# EAGLE design lpt_avr_programmer (EAGLE 5.10)
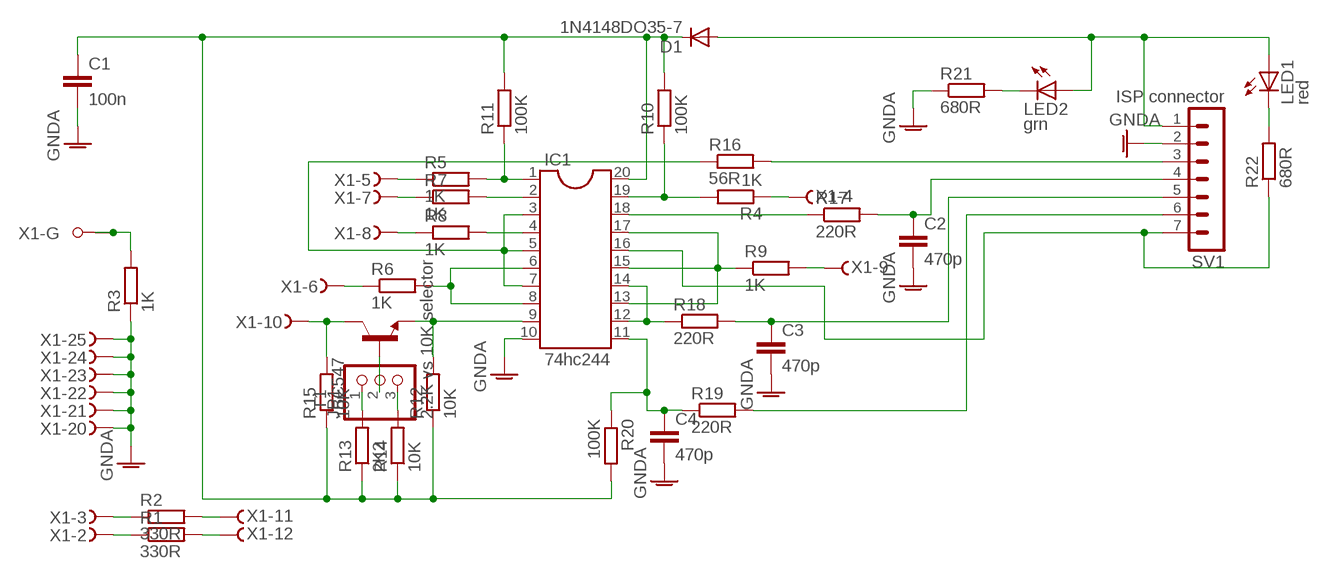
[diagram p0: schematic, sheet 1]

## Parts
C1  100n  C-EU050-025X075  [C050-025X075]
C2  470p  C-EU025-025X050  [C025-025X050]
C3  470p  C-EU025-025X050  [C025-025X050]
C4  470p  C-EU025-025X050  [C025-025X050]
D1  1N4148DO35-7  [DO35-7]
IC1  74hc244  DIL20  [DIL20]
JP1  2.2K vs 10K selector  PINHD-1X3  [1X03]
LED1  red  LED3MM  [LED3MM]
LED2  grn  LED3MM  [LED3MM]
R1  330R  RESISTOR-0207/28  [0207/28]
R2  330R  RESISTOR-0207/22  [0207/22]
R3  1K  R-EU_0207/7  [0207/7]
R4  1K  R-EU_0207/7  [0207/7]
R5  1K  R-EU_0207/7  [0207/7]
R6  1K  R-EU_0207/7  [0207/7]
R7  1K  R-EU_0207/7  [0207/7]
R8  1K  R-EU_0207/7  [0207/7]
R9  1K  RESISTOR-0207/22  [0207/22]
R10  100K  R-EU_0207/7  [0207/7]
R11  100K  R-EU_0207/7  [0207/7]
R12  10K  R-EU_0207/7  [0207/7]
R13  2K2  R-EU_0207/7  [0207/7]
R14  10K  R-EU_0207/7  [0207/7]
R15  10K  R-EU_0207/7  [0207/7]
R16  56R  R-EU_0207/7  [0207/7]
R17  220R  R-EU_0207/7  [0207/7]
R18  220R  R-EU_0207/7  [0207/7]
R19  220R  R-EU_0207/7  [0207/7]
R20  100K  R-EU_0207/7  [0207/7]
R21  680R  R-EU_0207/7  [0207/7]
R22  680R  R-EU_0207/7  [0207/7]
SV1  ISP connector  MA07-1  [MA07-1]
T1  BC547  [TO92]
X1  PC Parallel Port  F25HPS  [F25HP]

## Nets
GNDA: C1.2 C2.2 C3.2 C4.2 IC1.10 R3.1 R21.1 SV1.2 X1.20(-20:F) X1.21(-21:F) X1.22(-22:F) X1.23(-23:F) X1.24(-24:F) X1.25(-25:F)
N$1: R2.1 X1.3(-3:F)
N$2: R1.1 X1.2(-2:F)
N$3: R2.2 X1.11(-11:F)
N$4: R1.2 X1.12(-12:F)
N$5: R3.2 X1.G1(-G:G1) X1.G2(-G:G2)
N$6: R9.2 X1.9(-9:F)
N$7: R8.1 X1.8(-8:F)
N$8: R7.1 X1.7(-7:F)
N$9: R6.1 X1.6(-6:F)
N$10: R5.1 X1.5(-5:F)
N$11: R4.1 X1.4(-4:F)
N$12: C1.1 D1.C IC1.20 R10.2 R11.2 R12.1 R13.1 R14.1 R15.1 R20.2
N$13: IC1.19 R4.2 R10.1
N$14: IC1.1 R5.2 R11.1
N$15: IC1.6 IC1.8 R6.2
N$16: IC1.2 R7.2
N$17: IC1.4 R8.2
N$18: IC1.13 IC1.15 IC1.17 R9.1
N$19: IC1.9 R12.2 T1.1(E)
N$20: R15.2 T1.3(C) X1.10(-10:F)
N$21: JP1.2 T1.2(B)
N$22: JP1.1 R13.2
N$23: JP1.3 R14.2
N$24: R16.2 SV1.3
N$25: IC1.3 IC1.5 IC1.7 R16.1
N$26: IC1.18 R17.1
N$27: C2.1 R17.2 SV1.4
N$28: D1.A LED1.A LED2.A SV1.1
N$29: IC1.12 IC1.14 R18.1
N$30: C3.1 R18.2 SV1.5
N$31: C4.1 IC1.11 R19.1 R20.1
N$32: R19.2 SV1.6
N$33: IC1.16 R22.1 SV1.7
N$34: LED1.K(C) R22.2
N$36: LED2.K(C) R21.2
Unconnected: X1.1(-1:F) X1.13(-13:F) X1.14(-14:F) X1.15(-15:F) X1.16(-16:F) X1.17(-17:F) X1.18(-18:F) X1.19(-19:F)

## Library data of the parts
C1-C4 = resistor:C-EU: CAPACITOR, European symbol
D1 = diode:1N4148: DIODE high speed (Philips)
IC1 = ic-package:DIL20: Dual In Line / Socket
JP1 = pinhead:PINHD-1X3: PIN HEADER
LED1 LED2 = led:LED: LED OSRAM: - CHIPLED LG R971, LG N971, LY N971, LG Q971, LY Q971, LO R971, LY R971 LH N974, LH R974 LS Q976, LO Q976, LY Q976 LO Q996 - Hyper CHIPLED LW Q18S LB Q993, LB Q99A, LB R99A - SideLED LS A670, LO A670, LY A670, LG A670, LP A670 LB A673, LV A673, LT A673, LW A673 LH A674 LY A675 LS A676, LA A676, LO A676, LY A676, LW A676 LS A679, LY A679, LG A679 - Hyper Micro SIDELED® LS Y876, LA Y876, LO Y876, LY Y876 LT Y87S - SmartLED LW L88C, LW L88S LB L89C, LB L89S, LG L890 LS L89K, LO L89K, LY L89K LS L896, LA L896, LO L896, LY L896 - TOPLED LS T670, LO T670, LY T670, LG T670, LP T670 LSG T670, LSP T670, LSY T670, LOP T670, LYG T670 LG T671, LOG T671, LSG T671 LB T673, LV T673, LT T673, LW T673 LH T674 LS T676, LA T676, LO T676, LY T676, LB T676, LH T676, LSB T676, LW T676 LB T67C, LV T67C, LT T67C, LS T67K, LO T67K, LY T67K, LW E67C LS E67B, LA E67B, LO E67B, LY E67B, LB E67C, LV E67C, LT E67C LW T67C LS T679, LY T679, LG T679 LS T770, LO T770, LY T770, LG T770, LP T770 LB T773, LV T773, LT T773, LW T773 LH T774 LS E675, LA E675, LY E675, LS T675 LS T776, LA T776, LO T776, LY T776, LB T776 LHGB T686 LT T68C, LB T68C - Hyper Mini TOPLED® LB M676 - Mini TOPLED Santana® LG M470 LS M47K, LO M47K, LY M47K Source: http://www.osram.convergy.de LUXEON: - LUMILED® LXK2-PW12-R00, LXK2-PW12-S00, LXK2-PW14-U00, LXK2-PW14-V00 LXK2-PM12-R00, LXK2-PM12-S00, LXK2-PM14-U00 LXK2-PE12-Q00, LXK2-PE12-R00, LXK2-PE12-S00, LXK2-PE14-T00, LXK2-PE14-U00 LXK2-PB12-K00, LXK2-PB12-L00, LXK2-PB12-M00, LXK2-PB14-N00, LXK2-PB14-P00, LXK2-PB14-Q00 LXK2-PR12-L00, LXK2-PR12-M00, LXK2-PR14-Q00, LXK2-PR14-R00 LXK2-PD12-Q00, LXK2-PD12-R00, LXK2-PD12-S00 LXK2-PH12-R00, LXK2-PH12-S00 LXK2-PL12-P00, LXK2-PL12-Q00, LXK2-PL12-R00 Source: www.luxeon.com KINGBRIGHT: KA-3528ASYC Source: www.kingbright.com
R1 = resistor-custom:RESISTOR-0207/28
R2 R9 = resistor-custom:RESISTOR-0207/22
R3-R8 R10-R22 = resistor:R-EU_: RESISTOR, European symbol
SV1 = con-lstb:MA07-1: PIN HEADER
T1 = transistor:BC547: NPN TRANSISTOR
X1 = con-subd:F25HPS: SUB-D

## Board
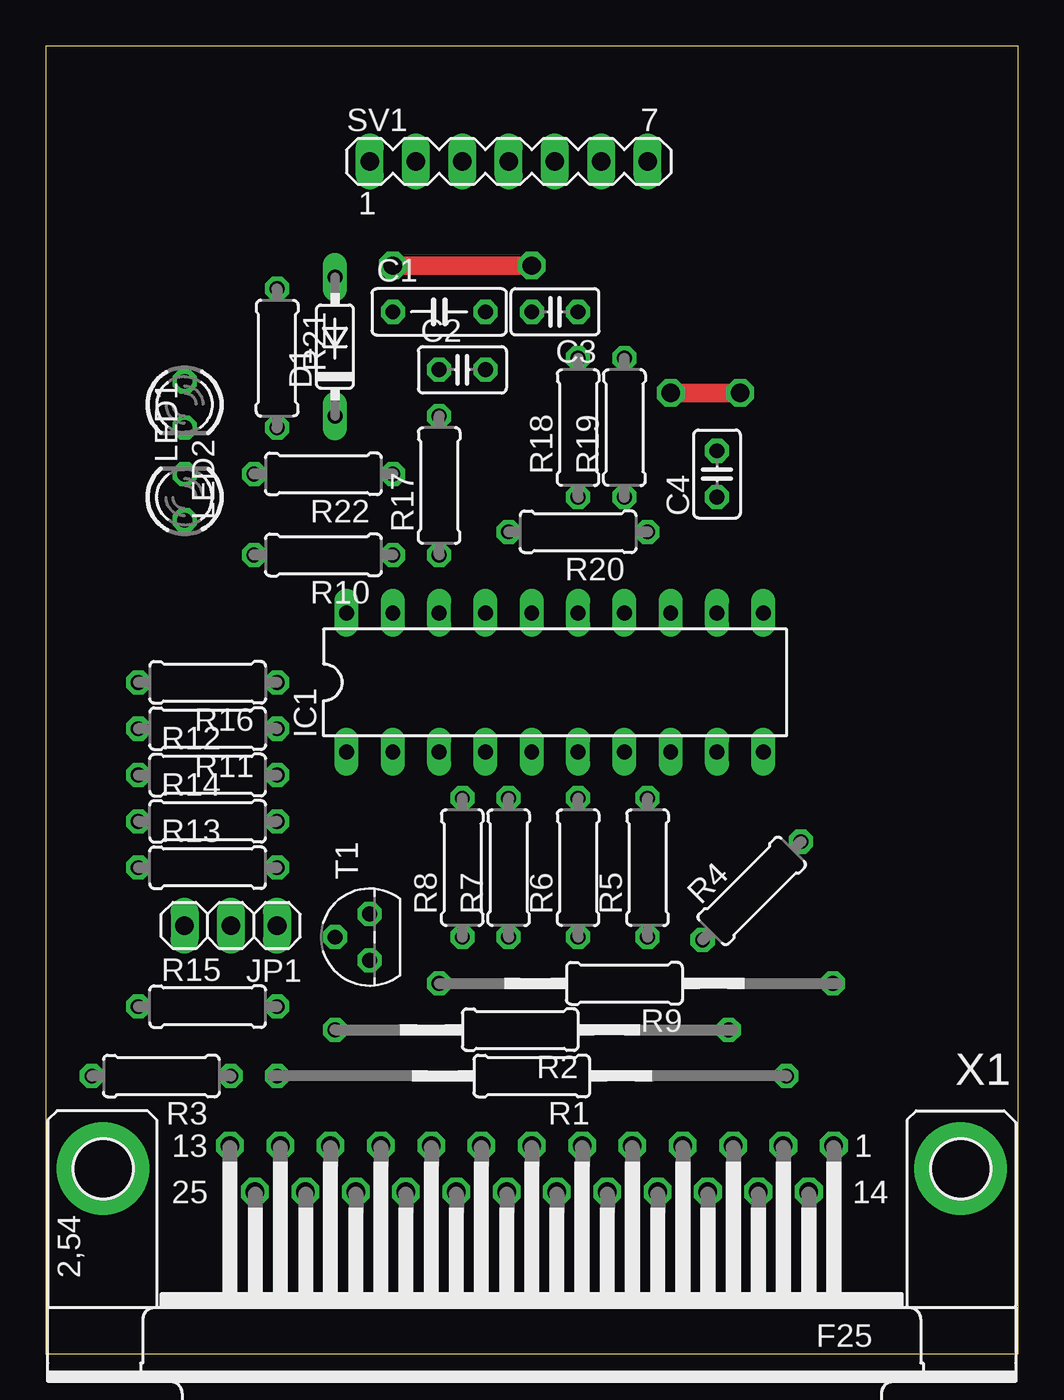
[diagram p1: board, top side]
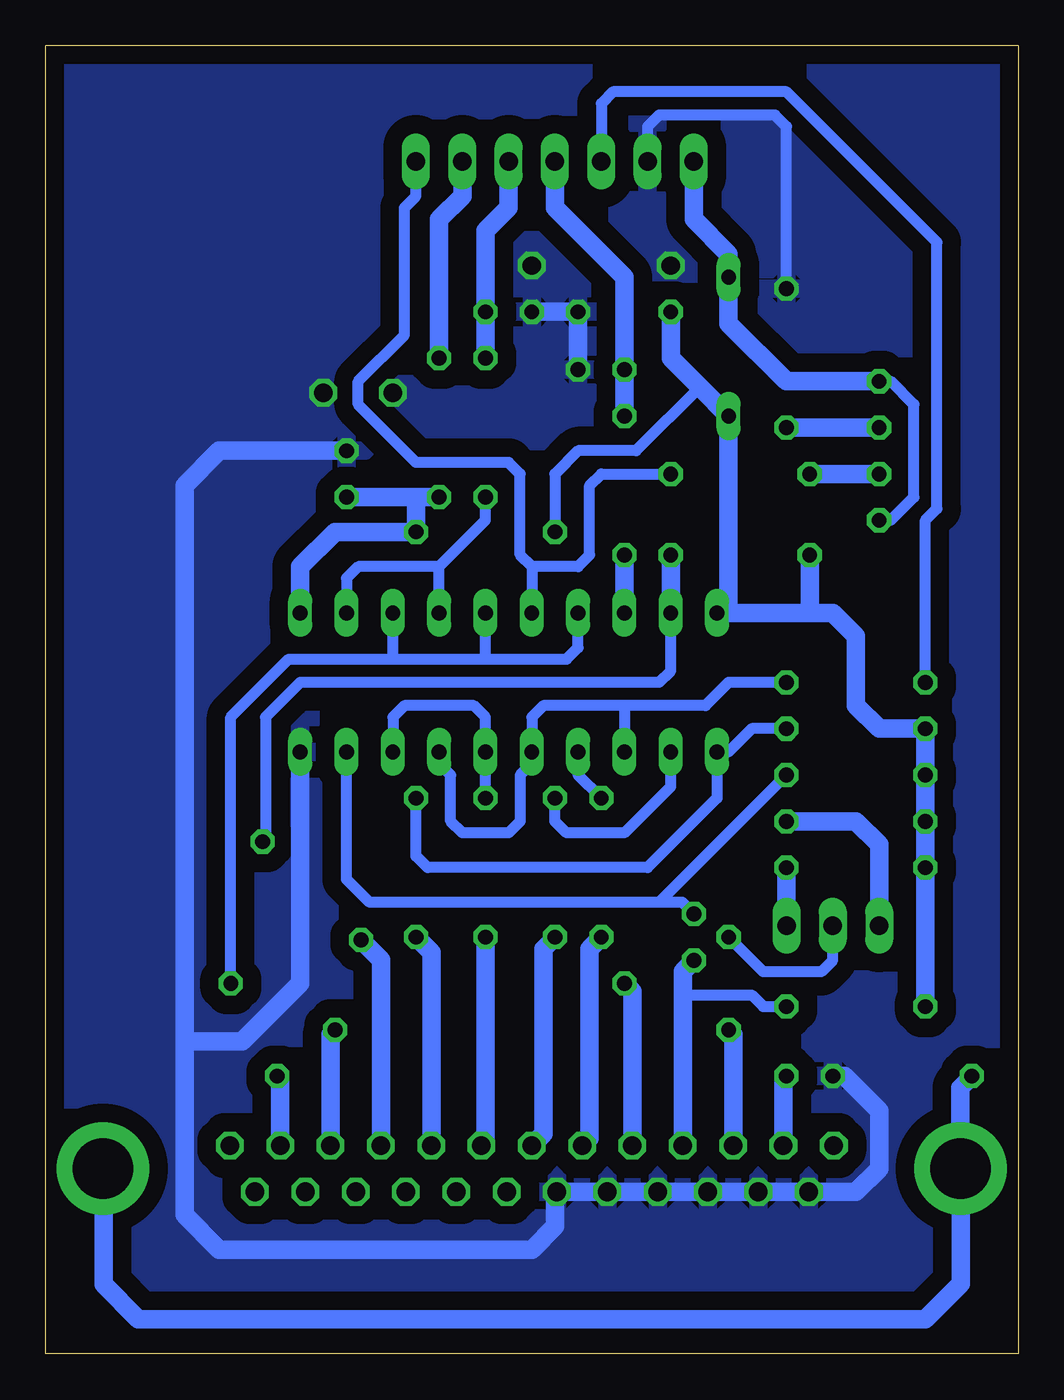
[diagram p2: board, bottom side, seen from below]

Size 53.34 x 71.75 mm. Coordinates in mm from the lower left corner, seen from the top.
Outline: 0,0 53.34,0 53.34,71.75 0,71.75 0,0
Copper layers (1*16): Top 0.035mm / dielectric 1.5mm / Bottom 0.035mm
Design rules "default *": minimum track width 20mil, minimum drill 20mil, track to track 20mil, track to pad 20mil, pad to pad 20mil, via to via 8mil, smd to smd 8mil, copper to edge 40mil, drill to drill 20mil, minimum pad ring 10mil, minimum via ring 8mil, stop-mask expansion 4mil, vias tented up to drill 0mil, thermal gap 10mil

### Footprints (pad centres in the part's own frame; a part is rotated, then mirrored left to right if it is on the bottom)
C050-025X075 = drill 0.813 octagon: 1 -2.54,0; 2 2.54,0
C025-025X050 = drill 0.813 octagon: 1 -1.27,0; 2 1.27,0
DO35-7 = drill 0.813 long: A 3.81,0; C -3.81,0
DIL20 = drill 0.813 long: 1 -11.43,-3.81; 2 -8.89,-3.81; 3 -6.35,-3.81; 4 -3.81,-3.81; 5 -1.27,-3.81; 6 1.27,-3.81; 7 3.81,-3.81; 8 6.35,-3.81; 9 8.89,-3.81; 10 11.43,-3.81; 11 11.43,3.81; 12 8.89,3.81; 13 6.35,3.81; 14 3.81,3.81; 15 1.27,3.81; 16 -1.27,3.81; 17 -3.81,3.81; 18 -6.35,3.81; 19 -8.89,3.81; 20 -11.43,3.81
1X03 = drill 1.016 long: 1 -2.54,0; 2 0,0; 3 2.54,0
LED3MM = drill 0.813 octagon: A -1.27,0; K 1.27,0
0207/28 = drill 0.813 octagon: 1 -13.97,0; 2 13.97,0
0207/22 = drill 0.813 octagon: 1 -11.43,0; 2 10.16,0
0207/7 = drill 0.813 octagon: 1 -3.81,0; 2 3.81,0
MA07-1 = drill 1.016 long: 1 -7.62,0; 2 -5.08,0; 3 -2.54,0; 4 0,0; 5 2.54,0; 6 5.08,0; 7 7.62,0
TO92 = drill 0.813 octagon: 1 1.27,0; 2 0,1.905; 3 -1.27,0
F25HP = drill 1.016 octagon: 1 -16.561,-1.27; 2 -13.792,-1.27; 3 -11.049,-1.27; 4 -8.28,-1.27; 5 -5.512,-1.27; 6 -2.769,-1.27; 7 0,-1.27; 8 2.769,-1.27; 9 5.512,-1.27; 10 8.28,-1.27; 11 11.049,-1.27; 12 13.792,-1.27; 13 16.561,-1.27; 14 -15.189,1.27; 15 -12.421,1.27; 16 -9.652,1.27; 17 -6.909,1.27; 18 -4.14,1.27; 19 -1.372,1.27; 20 1.372,1.27; 21 4.14,1.27; 22 6.909,1.27; 23 9.652,1.27; 24 12.421,1.27; 25 15.189,1.27 | drill 3.302 pad 5.08 round: G1 -23.52,0; G2 23.52,0

### Placement (x,y rotation side)
C1  21.59,57.15 0 top
C2  22.86,53.98 0 top
C3  27.94,57.15 180 top
C4  36.83,48.26 90 top
D1  15.87,55.24 90 top
IC1  27.94,36.83 0 top
JP1  10.16,23.5 180 top
LED1  7.62,46.99 90 top
LED2  7.62,52.07 270 top
R1  26.67,15.24 180 top
R2  26.04,17.78 180 top
R3  6.35,15.24 180 top
R4  38.73,25.4 45 top
R5  33.02,26.67 90 top
R6  29.21,26.67 90 top
R7  25.4,26.67 90 top
R8  22.86,26.67 90 top
R9  31.75,20.32 180 top
R10  15.24,43.81 180 top
R11  8.89,34.29 180 top
R12  8.89,31.75 0 top
R13  8.89,26.67 0 top
R14  8.89,29.21 0 top
R15  8.89,19.05 0 top
R16  8.89,36.83 180 top
R17  21.59,47.62 90 top
R18  29.21,50.8 90 top
R19  31.75,50.8 90 top
R20  29.21,45.09 180 top
R21  12.7,54.61 270 top
R22  15.24,48.26 180 top
SV1  25.4,65.41 0 top
T1  17.78,22.86 90 top
X1  26.67,10.16 180 top

### Tracks (layer width: path | path; a pad name or v marks a point on that pad's centre or on a via)
GNDA  (via drill 1)
  Top 1.016: v19.05,59.69 v26.67,59.69 | v34.29,52.7 v38.1,52.7
  Bottom 0.508: X1.20 25.4,8.89
  Bottom 0.61: R21.1 12.7,67.31 13.33,67.94 19.69,67.94 20.32,67.31 SV1.2
  Bottom 1.016: X1.20 X1.21 X1.22 X1.23 X1.24 X1.25 8.89,8.89 7.62,10.16 7.62,13.34 9.53,15.24 R3.1 | 25.4,8.89 25.4,6.99 26.67,5.71 43.81,5.71 45.72,7.62 45.72,17.14 | IC1.10 39.37,20.32 42.55,17.14 45.72,17.14 | C2.2 C1.2 C3.2 | 45.72,17.14 45.72,47.62 43.81,49.53 C4.2
  pour Bottom (isolate 1.016): -1.27,73.03 54.61,73.03 54.61,-1.27 -1.27,-1.27
N$1
  Bottom 1.016: X1.3 37.72,17.53 R2.1
N$2
  Bottom 1.016: X1.2 40.46,15.06 R1.1
N$3
  Bottom 1.016: X1.11 15.62,17.53 R2.2
N$4
  Bottom 1.016: X1.12 12.88,15.06 R1.2
N$5
  Bottom 1.016: R3.2 3.17,14.61 3.17,10.19 X1.G2 3.15,3.83 5.08,1.91 48.26,1.91 50.17,3.81 50.17,10.13 X1.G1
N$6
  Bottom 1.016: X1.9 21.16,19.89 R9.2
N$7
  Bottom 1.016: R8.1 23.5,22.23 23.5,11.84 X1.8
N$8
  Bottom 1.016: R7.1 26.04,22.23 26.04,12.06 X1.7
N$9
  Bottom 1.016: R6.1 29.21,11.66 X1.6
N$10
  Bottom 1.016: X1.5 32.18,22.02 R5.1
N$11
  Bottom 1.016: X1.4 34.95,21.61 R4.1
N$12
  Bottom 0.61: R20.2 25.4,48.26 24.13,49.53 20.95,49.53 17.46,53.02
  Bottom 1.016: R15.1 R13.1 R14.1 R12.1 R11.2 7.62,34.29 8.89,35.56 8.89,39.37 10.16,40.64 11.43,40.64 | 11.43,40.64 IC1.20 15.87,41.27 D1.C 17.46,53.02 19.05,54.61 C1.1 | 11.43,40.64 R10.2
N$13
  Bottom 0.61: IC1.19 19.05,37.47 19.69,36.83 39.37,36.83 41.27,34.92 41.27,28.25 R4.2
  Bottom 1.016: IC1.19 R10.1
N$14
  Bottom 0.61: R5.2 33.02,27.3 32.38,26.67 20.32,26.67 16.51,30.48 IC1.1 15.87,33.02 14.6,34.29 R11.1
N$15
  Bottom 0.61: R6.2 IC1.6 29.21,34.92 29.84,35.56 33.66,35.56 34.29,34.92 IC1.8
N$16
  Bottom 0.61: IC1.2 19.05,31.11 21.59,28.57 24.77,28.57 25.4,29.21 R7.2
N$17
  Bottom 0.61: IC1.4 24.13,31.75 R8.2
N$18
  Bottom 0.61: R9.1 43.18,34.92 40.01,38.1 34.29,38.1 | 34.29,38.1 29.21,38.1 | 29.21,38.1 24.77,38.1 24.13,38.73 IC1.17 | 29.21,38.1 IC1.15 | 34.29,38.1 IC1.13
N$19
  Bottom 0.61: T1.1 18.41,24.77 19.69,24.77 | 19.69,24.77 35.56,24.77 36.83,26.04 IC1.9 | 19.69,24.77 R12.2
N$20
  Bottom 0.61: T1.3 18.41,20.95 18.41,19.68 14.6,19.68 13.97,19.05 R15.2
  Bottom 1.016: X1.10 18.39,20.98 T1.3
N$21
  Bottom 0.61: T1.2 13.97,20.95 10.79,20.95 10.16,21.59 JP1.2
N$22
  Bottom 1.016: JP1.1 R13.2
N$23
  Bottom 1.016: R14.2 8.89,29.21 7.62,27.94 JP1.3
N$24
  Bottom 0.61: R16.2 5.08,45.72 4.44,46.35 4.44,60.96 12.7,69.22 22.23,69.22 22.86,68.58 SV1.3
N$25
  Bottom 0.61: IC1.7 31.75,32.38 31.12,31.75 31.12,29.21 30.48,28.57 27.94,28.57 27.3,29.21 27.3,31.75 26.67,32.38 IC1.5 26.67,34.92 26.04,35.56 21.59,35.56 | 21.59,35.56 IC1.3 | R16.1 15.87,36.83 17.14,35.56 21.59,35.56
N$26
  Bottom 1.016: IC1.18 R17.1
N$27
  Bottom 1.016: R17.2 C2.1 21.59,59.05 25.4,62.87 SV1.4
N$28
  Bottom 0.61: LED1.A 6.98,45.72 5.71,46.99 5.71,52.07 6.98,53.34 LED2.A
  Bottom 1.016: LED2.A 12.7,53.34 15.87,56.52 D1.A 15.87,60.33 17.78,62.23 SV1.1
N$29
  Bottom 0.61: IC1.12 36.83,42.55 36.2,43.18 31.75,43.18 | IC1.14 31.75,43.18 | R18.1 29.21,45.72 31.75,43.18
N$30
  Bottom 1.016: R18.2 C3.1 29.21,61.59 27.94,62.87 SV1.5
N$31
  Bottom 1.016: IC1.11 39.37,43.18 37.47,45.09 R20.1 33.02,46.99 | 33.02,46.99 R19.1 | 33.02,46.99 C4.1
N$32
  Bottom 1.016: SV1.6 30.48,63.5 31.75,62.23 R19.2
N$33
  Bottom 0.61: 26.67,43.18 IC1.16 | 26.67,43.18 27.3,43.81 27.3,48.26 27.94,48.9 33.02,48.9 36.2,52.07 36.2,53.34 33.66,55.88 33.66,62.87 33.02,63.5 SV1.7 | R22.1 22.86,48.26 23.5,47.62 23.5,43.81 24.13,43.18 26.67,43.18
N$34
  Bottom 1.016: LED1.K R22.2
N$36
  Bottom 1.016: LED2.K R21.2